# EAGLE design Electronics1,2 (EAGLE 9.4.2)
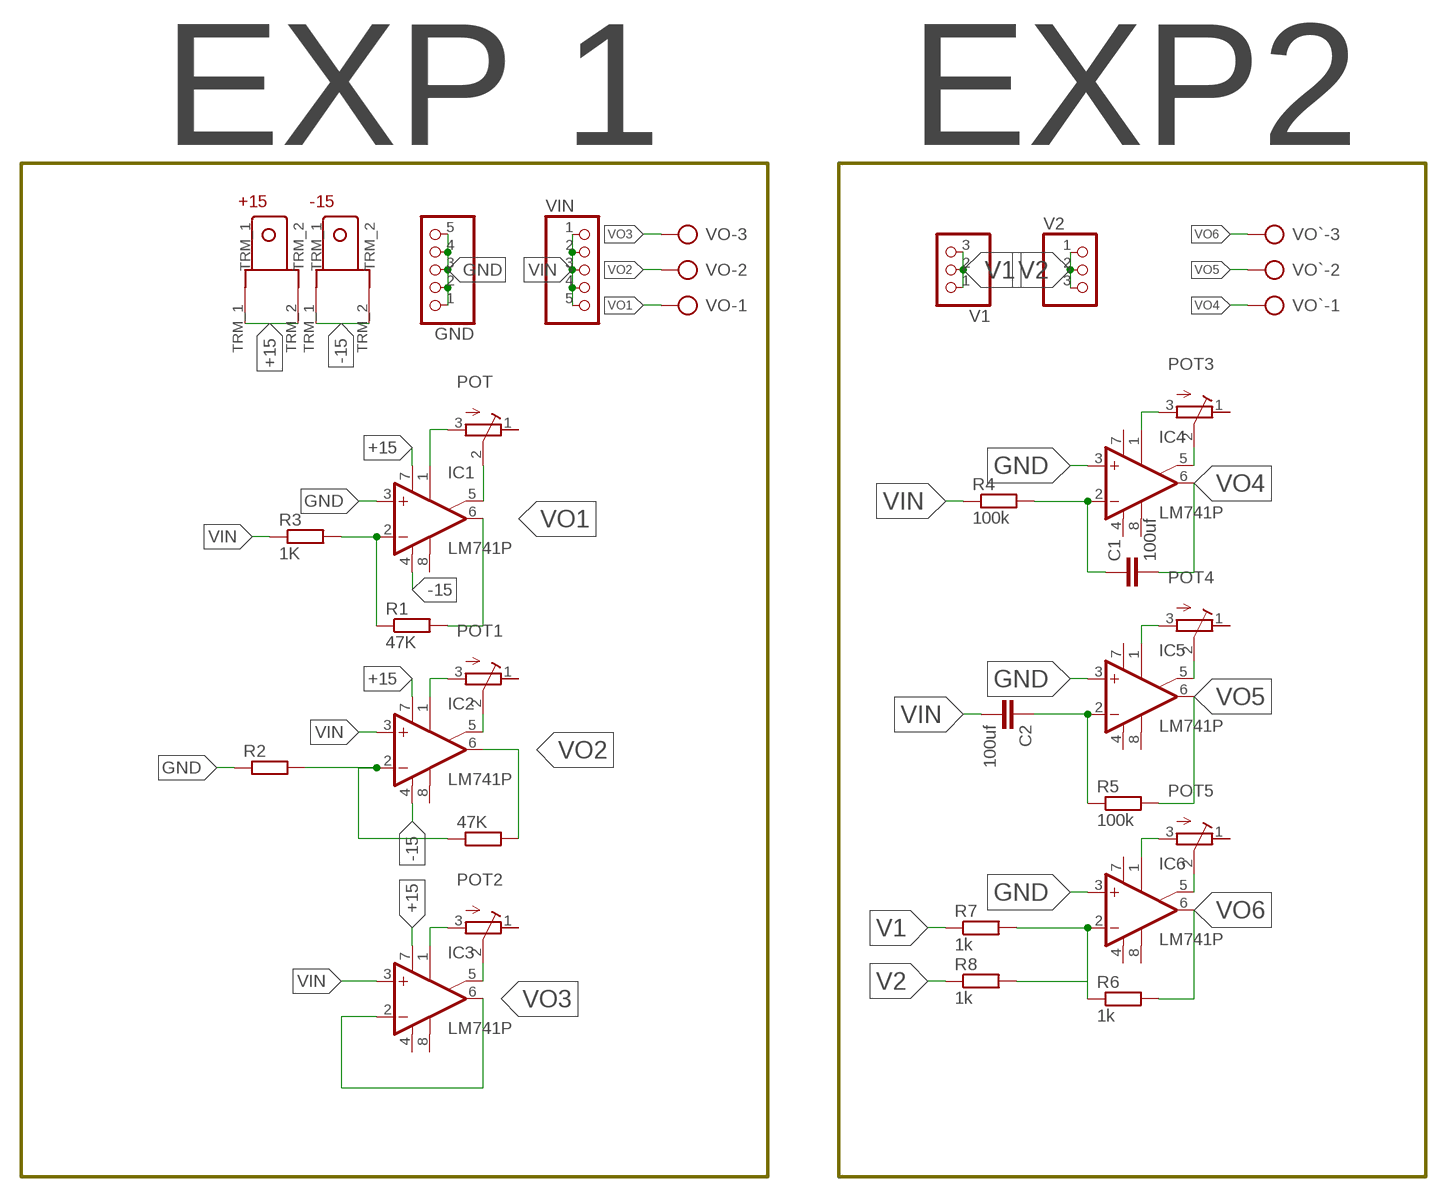
[diagram p0: schematic, sheet 1]

## Parts
47K  R-EU_0204/7  [0204/7]
+15  TERMINAL_EDITED  [TERMINAL_EDITED]
-15  TERMINAL_EDITED  [TERMINAL_EDITED]
C1  100uf  C-EU025-025X050  [C025-025X050]
C2  100uf  C-EU025-025X050  [C025-025X050]
GND  PINHD-1X5  [1X05]
IC1  LM741P  [DIL08]
IC2  LM741P  [DIL08]
IC3  LM741P  [DIL08]
IC4  LM741P  [DIL08]
IC5  LM741P  [DIL08]
IC6  LM741P  [DIL08]
POT  R-TRIMMT93XA  [RTRIMT93XA]
POT1  R-TRIMMT93XA  [RTRIMT93XA]
POT2  R-TRIMMT93XA  [RTRIMT93XA]
POT3  R-TRIMMT93XA  [RTRIMT93XA]
POT4  R-TRIMMT93XA  [RTRIMT93XA]
POT5  R-TRIMMT93XA  [RTRIMT93XA]
R1  47K  R-EU_0204/7  [0204/7]
R2  R-EU_0204/7  [0204/7]
R3  1K  R-EU_0204/7  [0204/7]
R4  100k  R-EU_0204/7  [0204/7]
R5  100k  R-EU_0204/7  [0204/7]
R6  1k  R-EU_0204/7  [0204/7]
R7  1k  R-EU_0204/7  [0204/7]
R8  1k  R-EU_0204/7  [0204/7]
V1  PINHD-1X3  [1X03]
V2  PINHD-1X3  [1X03]
VIN  PINHD-1X5  [1X05]
VO  CON_PTR_3  [AK300/3]
VO`  CON_PTR_3  [AK300/3]

## Nets
+15: +15.TRM_1 +15.TRM_2 IC1.7(V+) IC2.7(V+) IC3.7(V+)
-15: -15.TRM_1 -15.TRM_2 IC1.4(V-) IC2.4(V-)
GND: GND.1 GND.2 GND.3 GND.4 GND.5 IC1.3(+IN) IC4.3(+IN) IC5.3(+IN) IC6.3(+IN) R2.1
N$1: IC1.5(ON2) POT.2(S)
N$2: IC1.1(ON1) POT.3(A)
N$3: IC4.5(ON2) POT3.2(S)
N$4: IC1.2(-IN) R1.1 R3.2
N$5: IC3.5(ON2) POT2.2(S)
N$6: C1.1 IC4.2(-IN) R4.2
N$7: IC3.1(ON1) POT2.3(A)
N$8: IC2.5(ON2) POT1.2(S)
N$9: IC2.1(ON1) POT1.3(A)
N$10: IC4.1(ON1) POT3.3(A)
N$11: 47K.1 IC2.2(-IN) R2.2
N$12: IC5.5(ON2) POT4.2(S)
N$13: C2.1 IC5.2(-IN) R5.1
N$14: IC5.1(ON1) POT4.3(A)
N$15: IC6.5(ON2) POT5.2(S)
N$16: IC6.1(ON1) POT5.3(A)
N$18: IC6.2(-IN) R6.1 R7.2 R8.2
V1: R7.1 V1.1 V1.2 V1.3
V2: R8.1 V2.1 V2.2 V2.3
VIN: C2.2 IC2.3(+IN) IC3.3(+IN) R3.1 R4.1 VIN.1 VIN.2 VIN.3 VIN.4 VIN.5
VO1: IC1.6(OUT) R1.2 VO.1
VO2: 47K.2 IC2.6(OUT) VO.2
VO3: IC3.2(-IN) IC3.6(OUT) VO.3
VO4: C1.2 IC4.6(OUT) VO`.1
VO5: IC5.6(OUT) R5.2 VO`.2
VO6: IC6.6(OUT) R6.2 VO`.3
Unconnected: IC1.8(OPT) IC2.8(OPT) IC3.8(OPT) IC4.8(OPT) IC5.8(OPT) IC6.8(OPT) POT1.1(E) POT2.1(E) POT3.1(E) POT4.1(E) POT5.1(E) POT.1(E)

## Notes on the sheet
- EXP 1 | EXP2

## Power pins joined to a net without a drawn wire
V+: IC4.7(V+) IC5.7(V+) IC6.7(V+)
V-: IC3.4(V-) IC4.4(V-) IC5.4(V-) IC6.4(V-)

## Library data of the parts
47K R1-R8 = rcl:R-EU_: RESISTOR, European symbol; SPICEPREFIX: R
+15 -15 = MIA_LIBRARY-2-2-2:TERMINAL_EDITED
C1 C2 = rcl:C-EU: CAPACITOR, European symbol; SPICEPREFIX: C
GND VIN = MIA_LIBRARY-2-2-2:PINHD-1X5: PIN HEADER
IC1-IC6 = linear4:*741: OP AMP
POT POT1-POT5 = rcl:R-TRIMM: Trimm resistor; SPICEMODEL: X; SPICEPREFIXL: POT
V1 V2 = MIA_LIBRARY-2-2-2:PINHD-1X3: PIN HEADER
VO VO` = MIA_LIBRARY-2-2-2:CON_PTR_3: CONNECTOR; OC_FARNELL: unknown; OC_NEWARK: unknown

## Board
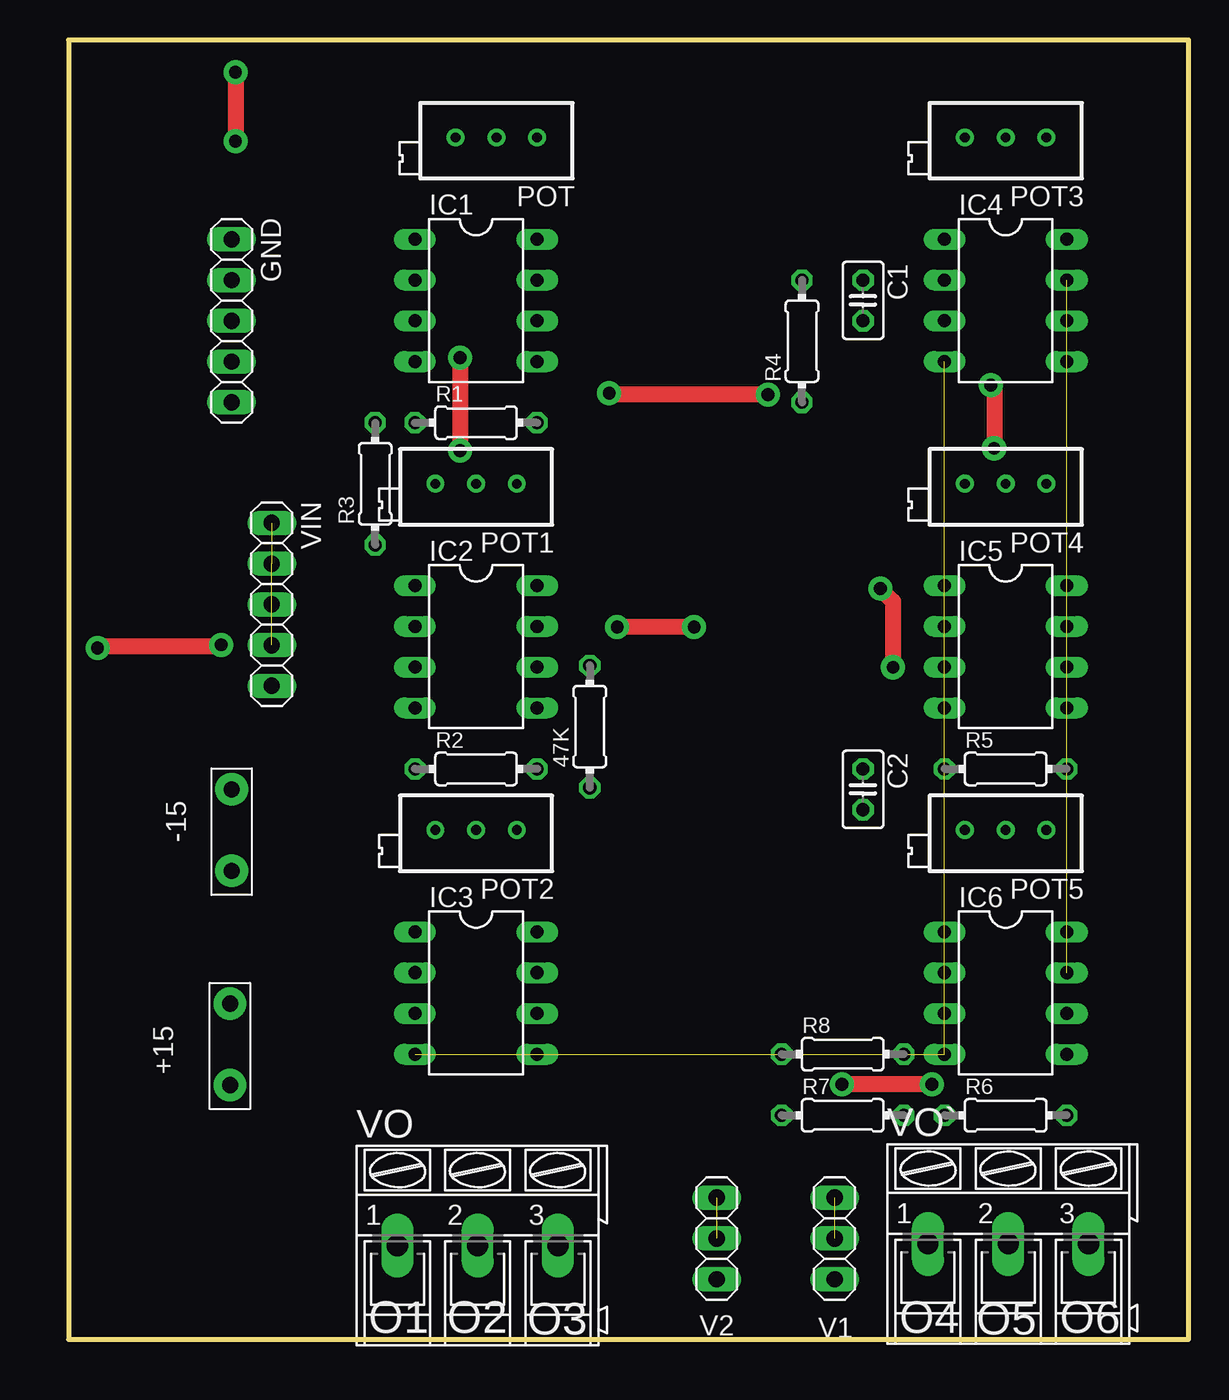
[diagram p1: board, top side]
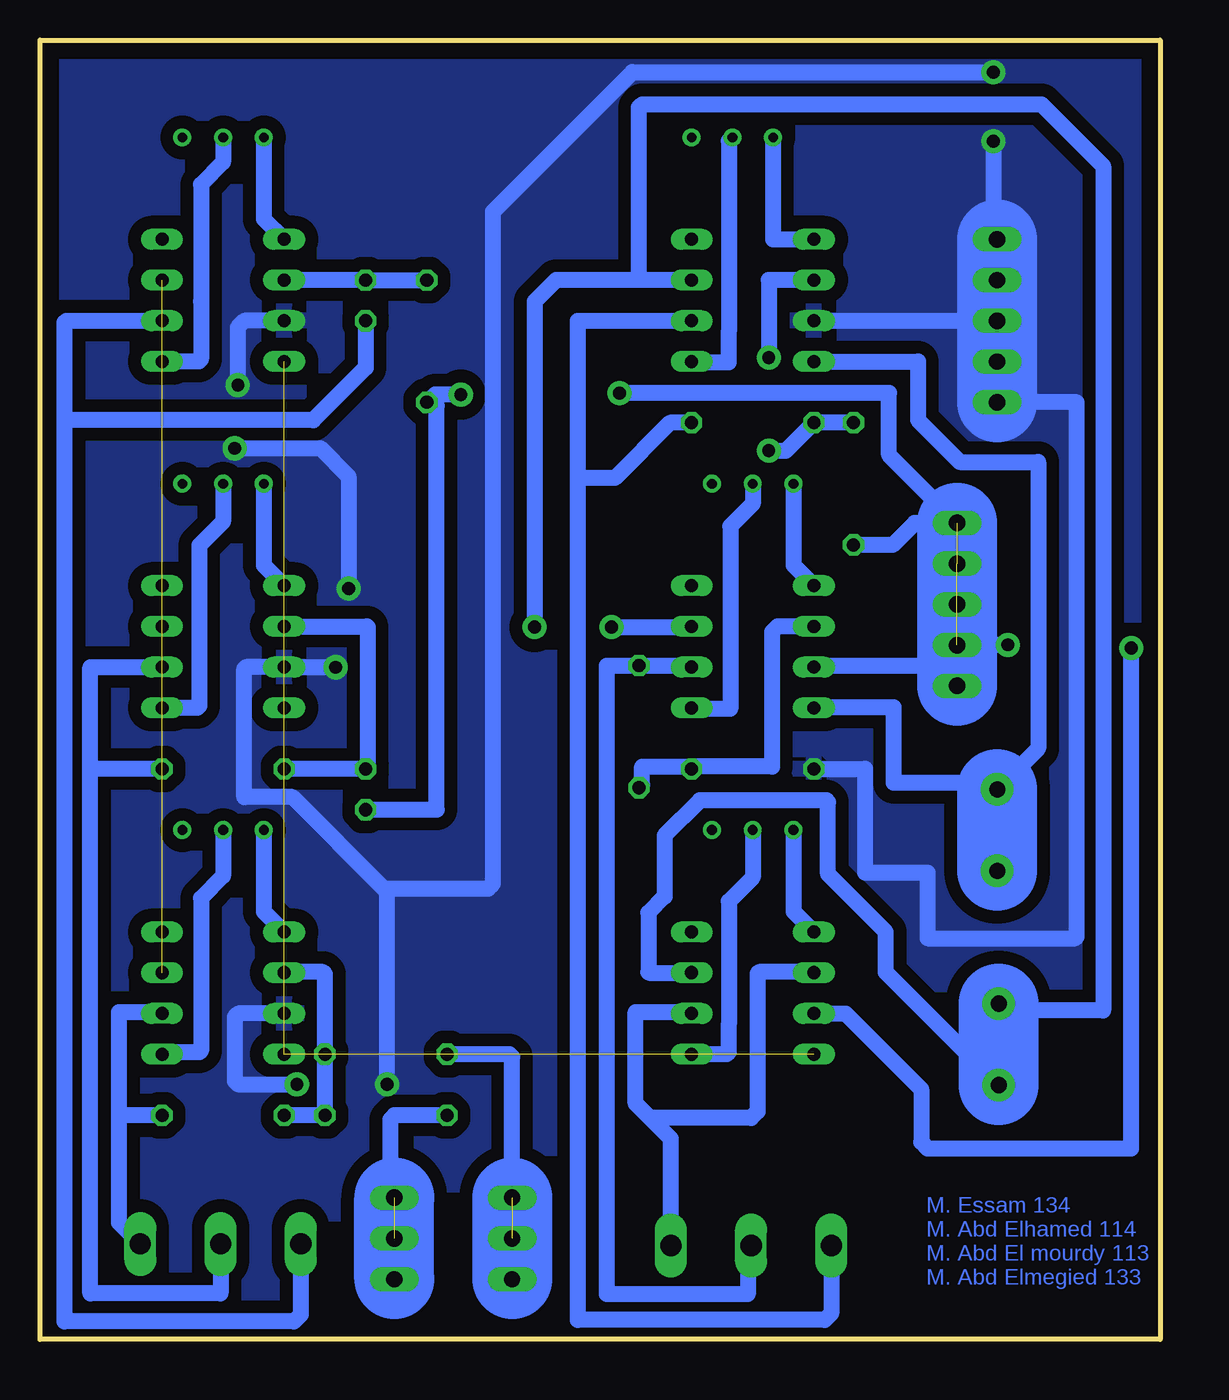
[diagram p2: board, bottom side, seen from below]

Size 69.83 x 81 mm. Coordinates in mm from the lower left corner, seen from the top.
Outline: 0,0 69.83,0 69.83,81 0,81 0,0
Copper layers (1*16): Top 0.035mm / dielectric 1.5mm / Bottom 0.035mm
Design rules "default *": minimum track width 0.7mm, minimum drill 0.35mm, track to track 0.5mm, track to pad 0.5mm, pad to pad 6mil, via to via 6mil, smd to smd 6mil, copper to edge 40mil, drill to drill 6mil, minimum pad ring 10mil, minimum via ring 8mil, stop-mask expansion 4mil, vias tented up to drill 0mil, thermal gap 10mil

### Footprints (pad centres in the part's own frame; a part is rotated, then mirrored left to right if it is on the bottom)
0204/7 = drill 0.813 octagon: 1 -3.81,0; 2 3.81,0
TERMINAL_EDITED = drill 1 pad 2.032: TRM_1 -2.54,0; TRM_2 2.54,0
C025-025X050 = drill 0.813 octagon: 1 -1.27,0; 2 1.27,0
1X05 = drill 1.016 long: 1 -5.08,0; 2 -2.54,0; 3 0,0; 4 2.54,0; 5 5.08,0
DIL08 = drill 0.813 long: 1 -3.81,-3.81; 2 -1.27,-3.81; 3 1.27,-3.81; 4 3.81,-3.81; 5 3.81,3.81; 6 1.27,3.81; 7 -1.27,3.81; 8 -3.81,3.81
RTRIMT93XA = drill 0.61: 1 0,-2.54; 2 0,0; 3 0,2.54
1X03 = drill 1.016 long: 1 -2.54,0; 2 0,0; 3 2.54,0
AK300/3 = drill 1.321 long: 1 -5.004,0; 2 0,0; 3 5.004,0

### Placement (x,y rotation side)
47K  32.49,38.2 90 top
+15  10.06,18.39 90 top
-15  10.16,31.75 90 top
C1  49.53,64.77 270 top
C2  49.53,34.29 270 top
GND  10.16,63.5 270 top
IC1  25.4,64.77 270 top
IC2  25.4,43.18 270 top
IC3  25.4,21.59 270 top
IC4  58.42,64.77 270 top
IC5  58.42,43.18 270 top
IC6  58.42,21.59 270 top
POT  26.67,74.93 90 top
POT1  25.4,53.34 90 top
POT2  25.4,31.75 90 top
POT3  58.42,74.93 90 top
POT4  58.42,53.34 90 top
POT5  58.42,31.75 90 top
R1  25.4,57.15 0 top
R2  25.4,35.56 0 top
R3  19.11,53.34 90 top
R4  45.72,62.23 90 top
R5  58.42,35.56 0 top
R6  58.42,13.97 0 top
R7  48.26,13.97 0 top
R8  48.26,17.78 0 top
V1  47.75,6.29 270 top
V2  40.4,6.29 270 top
VIN  12.66,45.82 270 top
VO  25.5,5.85 0 top
VO`  58.58,5.95 0 top

### Tracks (layer width: path | path; a pad name or v marks a point on that pad's centre or on a via)
+15  (via drill 0.8 pad 1.5)
  Top 1: v39,44.4 v34.2,44.4
  Bottom 1: +15.TRM_1 17.1,22.89 17.1,25.4 20.7,29 20.7,33.5 20.8,33.6 28.7,33.6 30.9,31.4 30.9,27.6 31.9,26.6 31.9,22.9 31.86,22.86 IC3.7 | IC1.7 32.44,66.04 | 32.44,66.04 32.5,66.1 32.5,76.8 32.3,77 7.4,77 3.55,73.15 3.55,20.5 9.63,20.5 +15.TRM_2 | 32.44,66.04 37.66,66.04 39,64.7 v39,44.4 | v34.2,44.4 29.26,44.4 IC2.7
  Bottom 5: +15.TRM_1 +15.TRM_2
-15
  Bottom 1: IC2.4 21.56,39.4 16.6,39.4 16.6,34.7 10.57,34.7 -15.TRM_2 7.6,36.85 7.6,54.7 12.49,54.7 15.1,57.31 15.1,60.96 IC1.4
  Bottom 5: -15.TRM_1 -15.TRM_2
GND  (via drill 0.8 pad 1.5)
  Top 1: v57.5,59.5 57.7,59.3 v57.7,55.55 | v50.6,46.8 51.4,46 v51.4,41.9 | v53.82,15.9 v48.2,15.9 | v10.4,79 v10.4,74.7
  Bottom 1: R2.1 18.4,35.56 18.4,29.1 14.5,29.1 14.5,25 5.3,25 5.2,25.1 5.2,58.42 GND.5 | IC1.3 10.26,63.5 10.16,63.4 | IC4.3 57.1,63.5 57.5,63.1 v57.5,59.5 | v57.7,55.55 52.35,55.55 50.6,53.8 v50.6,46.8 | v51.4,41.9 IC5.3 56.99,41.91 57.1,41.8 57.1,33.8 54.1,33.8 48.4,28.1 | IC6.3 57.48,20.32 57.7,20.1 57.7,16.1 57.5,15.9 v53.82,15.9 | v48.2,15.9 48.2,27.9 48.4,28.1 | 48.4,28.1 41.9,28.1 41.6,28.4 41.6,70.3 32.9,79 v10.4,79 | v10.4,74.7 10.4,68.82 GND.1
  Bottom 5: GND.5 10.16,63.4 GND.1
  pour Bottom (isolate 0.8): 0,80.7 69.5,80.7 70.8,79.4 70.8,0.9 69.3,-0.6 1.2,-0.6 -0.2,0.8 -0.2,80.6 -0.1,80.7
N$1
  Bottom 1: POT.2 26.89,74.71 26.89,62.81 26.9,62.8 26.9,60.9 29.15,60.9 IC1.5
N$2
  Bottom 1: POT.3 24.13,68.58 IC1.1
N$3
  Bottom 1: POT3.2 58.42,73.38 59.8,72 59.8,64.7 59.8,61.1 59.94,60.96 IC4.5
N$4  (via drill 0.8 pad 1.5)
  Top 1: v24.4,61.2 v24.4,55.4
  Bottom 1: R3.2 R1.1 23.34,55.4 v24.4,55.4 | IC1.2 24.4,66.04 v24.4,61.2
N$5
  Bottom 1: POT2.2 25.4,28.8 26.89,27.31 26.89,19.63 26.9,19.62 26.9,17.9 27.02,17.78 IC3.5
N$6
  Bottom 1: R4.2 C1.1 IC4.2
N$7
  Bottom 1: POT2.3 22.86,26.67 IC3.1
N$8
  Bottom 1: POT1.2 25.4,52.1 26.8,50.7 26.8,39.3 29.14,39.3 IC2.5
N$9
  Bottom 1: POT1.3 22.86,48.26 IC2.1
N$10
  Bottom 1: POT3.3 55.88,69.85 IC4.1
N$11
  Bottom 1: 47K.1 32.3,34.58 32.3,35.7 29.35,35.7 | 29.35,35.7 R2.2 | IC2.2 23.85,44.45 24.2,44.1 24.2,35.7 29.35,35.7
N$12
  Bottom 1: POT4.2 58.42,50.98 59.9,49.5 59.9,39.5 60.03,39.37 IC5.5
N$13
  Bottom 1: R5.1 C2.1 49.4,35.69 49.4,44.4 49.45,44.45 IC5.2
N$14
  Bottom 1: POT4.3 55.88,48.26 IC5.1
N$15
  Bottom 1: POT5.2 58.42,28.88 59.8,27.5 59.8,18 59.9,17.9 62.11,17.9 IC6.5
N$16
  Bottom 1: POT5.3 55.88,26.67 IC6.1
N$18
  Bottom 1: R6.1 R7.2 R8.2 52.07,22.77 52.2,22.9 54.57,22.9 IC6.2
V1  (1 unrouted)
  Bottom 1: R7.1 47.73,13.97 48,13.7 48,9.08 V1.1
  Bottom 5: V1.3 V1.1
V2  (1 unrouted)
  Bottom 1: V2.1 40.4,17.6 40.58,17.78 R8.1
  Bottom 5: V2.1 V2.3
V+  (2 unrouted)
V-  (3 unrouted)
VIN  (via drill 0.8 pad 1.5)  (3 unrouted)
  Top 1: v9.5,43.3 9.4,43.2 1.9,43.2 v1.8,43.1 | v33.7,59 33.8,58.9 v43.6,58.9
  Bottom 1: R3.1 16.67,49.53 15.3,50.9 VIN.1 16.9,55.14 16.9,59 v33.7,59 | IC2.3 21.49,42.01 14.05,42.01 12.66,43.4 12.56,43.3 v9.5,43.3 | C2.2 45.1,33.02 45.1,58.2 45.32,58.42 | 45.32,58.42 R4.1 | IC3.3 19.62,20.32 14.9,15.6 14.9,12.3 14.5,11.9 1.8,11.9 v1.8,43.1 | v43.6,58.9 45.2,58.9 45.32,58.78 45.32,58.42
  Bottom 5: VIN.1 12.66,43.4 VIN.5
VO1
  Bottom 1: VO.1 20.5,1.62 20.9,1.22 36.3,1.22 36.3,53.7 | 36.3,53.7 36.3,63.5 IC1.6 | R1.2 30.55,57.15 34,53.7 36.3,53.7
VO2
  Bottom 1: VO.2 25.7,5.65 25.7,2.82 34.5,2.82 34.5,42 47K.2 29.31,42.01 IC2.6
VO3
  Bottom 1: VO.3 30.5,12.5 31.8,13.8 | 31.8,13.8 32.7,14.7 32.7,20.4 29.29,20.4 IC3.6 | IC3.2 21.63,22.9 25,22.9 25.1,22.8 25.1,14.2 25.5,13.8 31.8,13.8
VO4
  Bottom 1: VO`.1 53.58,1.53 53.99,1.12 68.3,1.12 68.3,57.3 | 68.3,57.3 68.3,63.4 68.2,63.5 IC4.6 | C1.2 49.53,60.57 52.8,57.3 68.3,57.3
VO5
  Bottom 1: VO`.2 58.58,2.87 66.7,2.87 66.7,35.8 | 66.7,35.8 66.7,41.91 IC5.6 | R5.2 66.46,35.56 66.7,35.8
VO6
  Bottom 1: VO`.3 64.9,7.27 64.9,13.7 | 64.9,13.7 64.9,20.4 62.31,20.4 IC6.6 | R6.2 64.63,13.97 64.9,13.7

### Text on the board
Bottom: M. Essam 134 / M. Abd Elhamed 114 / M. Abd El mourdy 113 / M. Abd Elmegied 133
tNames: O1 | O2 | O3 | O4 | O5 | O6